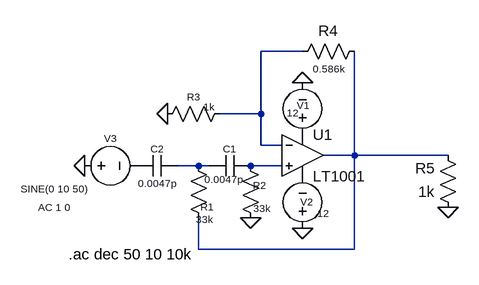
[diagram p0: schematic 7a2.AC HIGH PASS.asc]
7a2.AC HIGH PASS.asc, the LTspice schematic file:
Version 4
SHEET 1 880 680
WIRE 288 0 224 0
WIRE 224 96 224 0
WIRE 224 96 160 96
WIRE 224 144 224 96
WIRE 256 144 224 144
WIRE 368 160 368 0
WIRE 368 160 320 160
WIRE 512 160 368 160
WIRE 128 176 96 176
WIRE 144 176 128 176
WIRE 208 176 192 176
WIRE 256 176 208 176
WIRE 128 304 128 256
WIRE 368 304 368 160
WIRE 368 304 128 304
FLAG 208 256 0
FLAG 288 272 0
FLAG 288 48 0
FLAG 80 96 0
FLAG -48 176 0
FLAG 512 240 0
SYMBOL OpAmps\\LT1001 288 96 R0
SYMATTR InstName U1
SYMBOL res 144 272 R180
WINDOW 0 -7 33 Left 1
WINDOW 3 -6 14 Left 1
SYMATTR InstName R1
SYMATTR Value 33k
SYMBOL res 224 272 R180
WINDOW 0 -8 66 Left 1
WINDOW 3 -14 31 Left 1
SYMATTR InstName R2
SYMATTR Value 33k
SYMBOL res 176 80 R90
WINDOW 0 0 56 VBottom 1
WINDOW 3 -5 32 VTop 1
SYMATTR InstName R3
SYMATTR Value 1k
SYMBOL res 384 -16 R90
WINDOW 0 0 56 VBottom 2
WINDOW 3 32 56 VTop 1
SYMATTR InstName R4
SYMATTR Value 0.586k
SYMBOL res 528 256 R180
WINDOW 0 36 76 Left 2
WINDOW 3 36 40 Left 2
SYMATTR InstName R5
SYMATTR Value 1k
SYMBOL cap 208 160 R90
WINDOW 0 0 32 VBottom 1
WINDOW 3 26 42 VTop 1
SYMATTR InstName C1
SYMATTR Value 0.0047p
SYMBOL cap 96 160 R90
WINDOW 0 0 32 VBottom 1
WINDOW 3 32 32 VTop 1
SYMATTR InstName C2
SYMATTR Value 0.0047p
SYMBOL voltage 288 144 R180
WINDOW 0 -11 61 Left 1
WINDOW 3 6 50 Left 1
WINDOW 123 0 0 Left 0
WINDOW 39 0 0 Left 0
SYMATTR InstName V1
SYMATTR Value 12
SYMBOL voltage 288 288 R180
WINDOW 0 -16 57 Left 1
WINDOW 3 -41 39 Left 1
WINDOW 123 0 0 Left 0
WINDOW 39 0 0 Left 0
SYMATTR InstName V2
SYMATTR Value 12
SYMBOL voltage -64 176 R270
WINDOW 0 32 56 VTop 1
WINDOW 3 -25 -31 VBottom 1
WINDOW 123 -53 -31 VBottom 1
WINDOW 39 0 0 Left 0
SYMATTR InstName V3
SYMATTR Value SINE(0 10 50)
SYMATTR Value2 AC 1 0
TEXT -72 312 Left 2 !.ac dec 50 10 10k

The netlist it stands for:
* 7a2.AC HIGH PASS.asc
XU1 N004 N001 P001 P002 N002 LT1001  ; pins In+ In- V+ V- OUT
R1 N002 N003 33k
R2 0 N004 33k
R3 N001 0 1k
R4 N002 N001 0.586k
R5 0 N002 1k
C1 N004 N003 0.0047p
C2 N003 P003 0.0047p
V1 P001 0 12
V2 0 P002 12
V3 0 P003 SINE(0 10 50) AC 1 0
.ac dec 50 10 10k
.lib LTC.lib
.backanno
.end